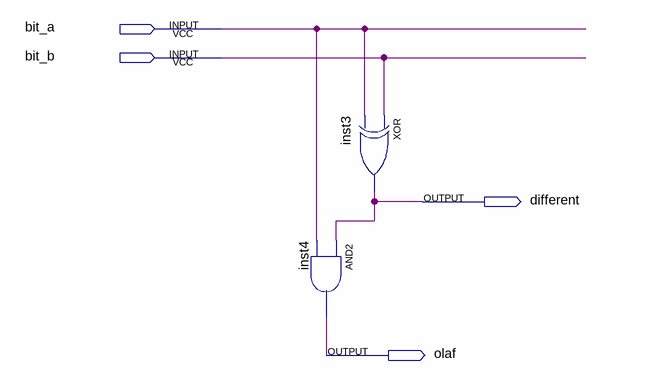
[diagram p0: schematic sheet]
// Quartus schematic bitcmp.bdf as structural Verilog: 2 symbols, 4 pins
module bitcmp (
  input  bit_a,
  input  bit_b,
  output different,
  output olaf
);

  xor inst3 (different, bit_b, bit_a);
  and inst4 (olaf, different, bit_a);
endmodule
